# EAGLE design usb-break-out (EAGLE 6.5.0)
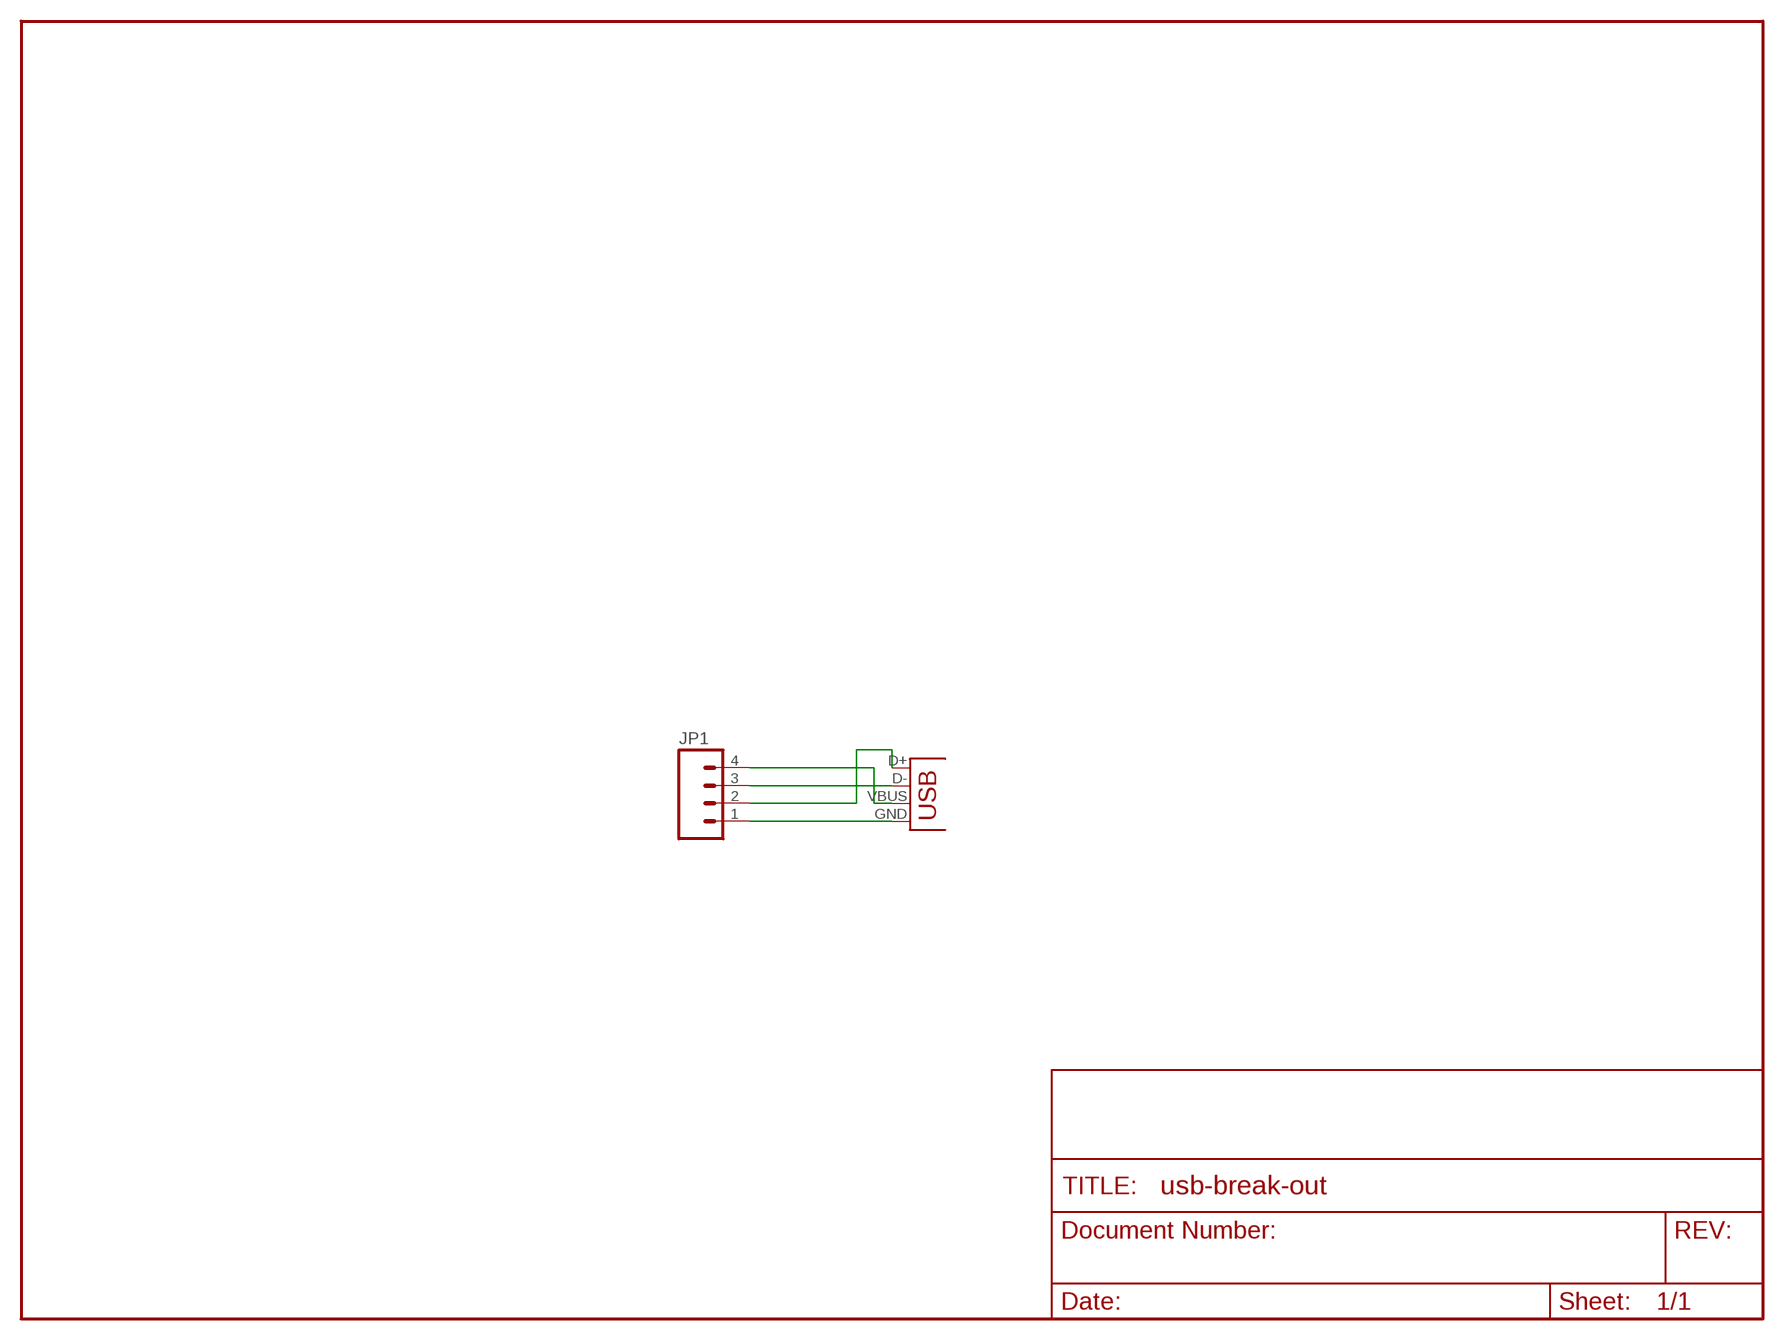
[diagram p0: schematic, sheet 1]

## Parts
A  USB-A-S  [USB-A-S]
JP1  M04POLAR  [MOLEX-1X4]

## Nets
D+: A.D+ JP1.2
D-: A.D- JP1.3
GND: A.GND JP1.1
VBUS: A.VBUS JP1.4

## Library data of the parts
A = Custom:USB: USB Connectors
JP1 = SparkFun:M04: Header 4 Standard 4-pin 0.1" header. Use with straight break away headers (SKU : PRT-00116), right angle break away headers (PRT-00553), swiss pins (PRT-00743), machine pins (PRT-00117), and female headers (PRT-00115). Molex polarized connector foot print use with SKU : PRT-08231 with associated crimp pins and housings.

## Board
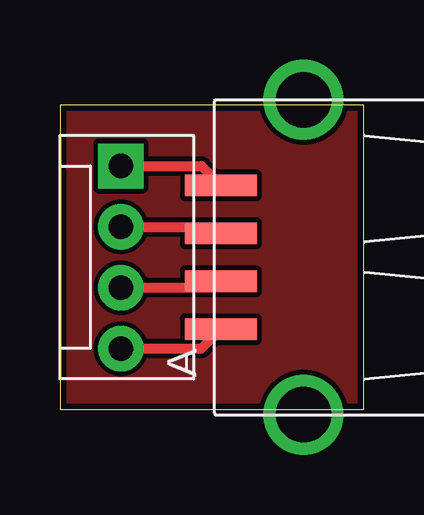
[diagram p1: board, top side]

Size 12.68 x 12.7 mm. Coordinates in mm from the lower left corner, seen from the top.
Outline: 0,0 12.68,0 12.68,12.7 0,12.7 0,0
Copper layers (1*16): Top 0.035mm / dielectric 1.5mm / Bottom 0.035mm
Design rules "default": minimum track width 8mil, minimum drill 20mil, track to track 8mil, track to pad 8mil, pad to pad 8mil, via to via 8mil, smd to smd 8mil, copper to edge 10mil, drill to drill 8mil, minimum pad ring 12mil, minimum via ring 10mil, stop-mask expansion 4mil, vias tented up to drill 25mil, thermal gap 10mil

### Footprints (pad centres in the part's own frame; a part is rotated, then mirrored left to right if it is on the bottom)
USB-A-S = smd 3 x 0.9: D+ 3.45,-1; D- 3.45,1; GND 3.45,-3; VBUS 3.45,3 | drill 2.311: P$5 0,-6.566; P$6 0,6.566
MOLEX-1X4 = drill 1.016 pad 1.88 square: 1 0,0 | drill 1.016 pad 1.88: 2 2.54,0; 3 5.08,0; 4 7.62,0

### Placement (x,y rotation side)
A  10.16,6.35 180 top
JP1  2.54,10.16 270 top

### Tracks (layer width: path | path; a pad name or v marks a point on that pad's centre or on a via)
D+
  Top 0.254: 6.44,7.62 A.D+
  Top 0.406: JP1.2 6.44,7.62
D-
  Top 0.254: 6.44,5.08 A.D-
  Top 0.406: JP1.3 6.44,5.08
GND
  Top 0.406: JP1.1 5.9,10.16 A.GND
GND1
  pour Top: 0,12.7 0,0 12.7,0 12.7,12.7
VBUS
  Top 0.406: JP1.4 5.9,2.54 A.VBUS

### Text on the board
bDocu: GND | D+ | D- | VBUS